# EAGLE schematic RecifierBox (EAGLE 9.4.2)
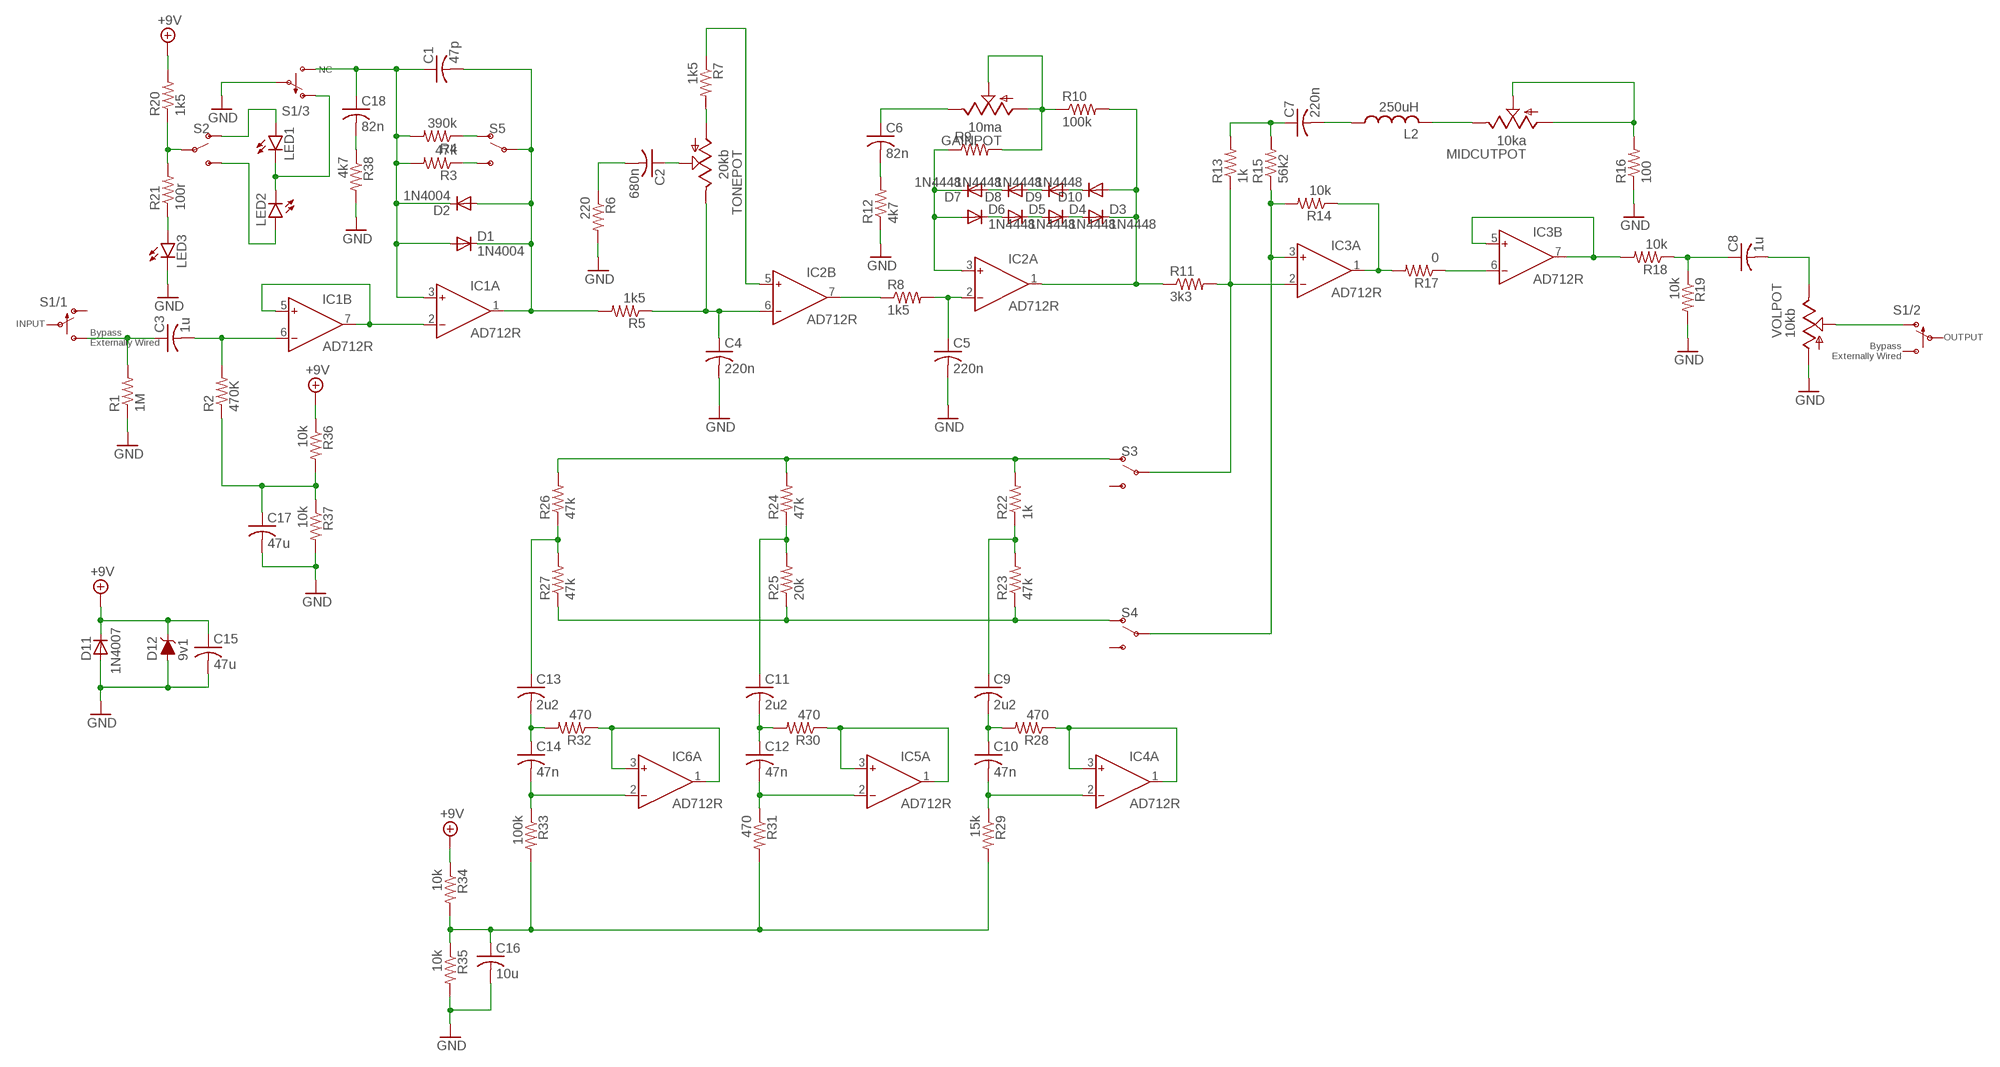
[diagram p0: schematic, sheet 1]

## Parts
C1  47p  C-USC0603  [C0603]
C2  680n  C-USC0603  [C0603]
C3  1u  C-USC0603  [C0603]
C4  220n  C-USC0603  [C0603]
C5  220n  C-USC0603  [C0603]
C6  82n  C-USC0603  [C0603]
C7  220n  C-USC0603  [C0603]
C8  1u  C-USC0603  [C0603]
C9  2u2  C-USC0603  [C0603]
C10  47n  C-USC0603  [C0603]
C11  2u2  C-USC0603  [C0603]
C12  47n  C-USC0603  [C0603]
C13  2u2  C-USC0603  [C0603]
C14  47n  C-USC0603  [C0603]
C15  47u  C-US050-025X075  [C050-025X075]
C16  10u  C-USC0603  [C0603]
C17  47u  C-US050-025X075  [C050-025X075]
C18  82n  C-USC0603  [C0603]
D1  1N4004  [DO41-10]
D2  1N4004  [DO41-10]
D3  1N4448  1N4004  [DO41-10]
D4  1N4448  1N4004  [DO41-10]
D5  1N4448  1N4004  [DO41-10]
D6  1N4448  1N4004  [DO41-10]
D7  1N4448  1N4004  [DO41-10]
D8  1N4448  1N4004  [DO41-10]
D9  1N4448  1N4004  [DO41-10]
D10  1N4448  1N4004  [DO41-10]
D11  1N4007  1N4004  [DO41-10]
D12  9v1  DIODE-ZENER-BZT52C3V6S  [SOD-323]
GAIN  10ma  THUMBPOT  [THUMBWHEEL]
IC1  AD712R  [SO8]
IC2  AD712R  [SO8]
IC3  AD712R  [SO8]
IC4  AD712R  [SO8]
IC5  AD712R  [SO8]
IC6  AD712R  [SO8]
L2  250uH  L-US0204/5  [0204/5]
LED1  LED3MM  [LED3MM]
LED2  LED3MM  [LED3MM]
LED3  LED3MM  [LED3MM]
MIDCUT  10ka  THUMBPOT  [THUMBWHEEL]
R1  1M  R-US_R0603  [R0603]
R2  470K  R-US_R0603  [R0603]
R3  47k  R-US_R0603  [R0603]
R4  390k  R-US_R0603  [R0603]
R5  1k5  R-US_R0603  [R0603]
R6  220  R-US_R0603  [R0603]
R7  1k5  R-US_R0603  [R0603]
R8  1k5  R-US_R0603  [R0603]
R9  R-US_R0603  [R0603]
R10  100k  R-US_R0603  [R0603]
R11  3k3  R-US_R0603  [R0603]
R12  4k7  R-US_R0603  [R0603]
R13  1k  R-US_R0603  [R0603]
R14  10k  R-US_R0603  [R0603]
R15  56k2  R-US_R0603  [R0603]
R16  100  R-US_R0603  [R0603]
R17  0  R-US_R0603  [R0603]
R18  10k  R-US_R0603  [R0603]
R19  10k  R-US_R0603  [R0603]
R20  1k5  R-US_R0603  [R0603]
R21  100r  R-US_R0603  [R0603]
R22  1k  R-US_R0603  [R0603]
R23  47k  R-US_R0603  [R0603]
R24  47k  R-US_R0603  [R0603]
R25  20k  R-US_R0603  [R0603]
R26  47k  R-US_R0603  [R0603]
R27  47k  R-US_R0603  [R0603]
R28  470  R-US_R0603  [R0603]
R29  15k  R-US_R0603  [R0603]
R30  470  R-US_R0603  [R0603]
R31  470  R-US_R0603  [R0603]
R32  470  R-US_R0603  [R0603]
R33  100k  R-US_R0603  [R0603]
R34  10k  R-US_R0603  [R0603]
R35  10k  R-US_R0603  [R0603]
R36  10k  R-US_R0603  [R0603]
R37  10k  R-US_R0603  [R0603]
R38  4k7  R-US_R0603  [R0603]
S1  SWITCH-3DPT-INLINE-BREAKOUT-BYPASS  [1X04]
S2  SWITCH-SPDT-PTH-11.6X4.0MM  [SWITCH_SPDT_PTH_11.6X4.0MM]
S3  SWITCH-SPDT-PTH-11.6X4.0MM  [SWITCH_SPDT_PTH_11.6X4.0MM]
S4  SWITCH-SPDT-PTH-11.6X4.0MM  [SWITCH_SPDT_PTH_11.6X4.0MM]
S5  SWITCH-SPDT-PTH-11.6X4.0MM  [SWITCH_SPDT_PTH_11.6X4.0MM]
TONE  20kb  THUMBPOT  [THUMBWHEEL]
VOL  10kb  THUMBPOT  [THUMBWHEEL]

## Nets
+9V: C15.1 D11.C D12.C R20.2 R34.1 R36.1
GND: C4.2 C5.2 C15.2 C16.2 C17.2 D11.A D12.A LED3.K(C) R1.1 R6.2 R12.1 R16.1 R19.2 R35.2 R37.2 R38.2 S1.3(/3:COMMON) VOL.1(POT:A)
N$1: C3.1 R1.2
N$2: C3.2 IC1.6(B:IN-) R2.2
N$4: C18.2 R38.1
N$5: IC1.2(A:IN-) IC1.5(B:IN+) IC1.7(B:OUT)
N$6: C1.1 C18.1 D1.A D2.C IC1.3(A:IN+) R3.2 R4.2
N$7: C2.2 R6.1
N$8: C2.1 TONE.2(POT:S)
N$9: R7.2 TONE.1(POT:A)
N$10: IC2.5(B:IN+) R7.1
N$11: C4.1 IC2.6(B:IN-) R5.1 TONE.3(POT:E)
N$12: IC2.7(B:OUT) R8.1
N$13: C5.1 IC2.2(A:IN-) R8.2
N$14: D5.A D6.C
N$15: D4.A D5.C
N$16: D3.A D4.C
N$17: D7.A D8.C
N$18: D8.A D9.C
N$19: D9.A D10.C
N$20: D6.A D7.C IC2.3(A:IN+) R9.1
N$21: GAIN.1(POT:A) GAIN.2(POT:S) R9.2 R10.1
N$22: D3.C D10.A IC2.1(A:OUT) R10.2 R11.1
N$23: C6.2 R12.2
N$24: C6.1 GAIN.3(POT:E)
N$25: IC3.2(A:IN-) R11.2 R13.1 S3.2(P)
N$26: C7.1 R13.2 R15.2
N$27: IC3.3(A:IN+) R14.2 R15.1 S4.2(P)
N$28: C7.2 L2.1
N$29: L2.2 MIDCUT.3(POT:E)
N$30: MIDCUT.1(POT:A) MIDCUT.2(POT:S) R16.2
N$31: IC3.1(A:OUT) R14.1 R17.2
N$32: IC3.6(B:IN-) R17.1
N$33: IC3.5(B:IN+) IC3.7(B:OUT) R18.2
N$34: C8.1 R18.1 R19.1
N$35: C8.2 VOL.3(POT:E)
N$36: S1.2(/2:NORMALLY-ON) VOL.2(POT:S)
N$37: LED1.K(C) LED2.K(C) S1.4(/3:NORMALLY-ON)
N$38: R20.1 R21.2 S2.2(P)
N$39: LED1.A S2.1(O)
N$40: LED2.A S2.3(S)
N$41: LED3.A R21.1
N$42: R22.2 R24.2 R26.2 S3.1(O)
N$43: R23.1 R25.1 R27.1 S4.1(O)
N$44: C9.1 R22.1 R23.2
N$45: C16.1 R29.2 R31.2 R33.2 R34.2 R35.1
N$46: C11.1 R24.1 R25.2
N$47: C9.2 C10.1 R28.2
N$48: IC4.1(A:OUT) IC4.3(A:IN+) R28.1
N$49: C10.2 IC4.2(A:IN-) R29.1
N$50: C17.1 R2.1 R36.2 R37.1
N$51: C13.1 R26.1 R27.2
N$52: C11.2 C12.1 R30.2
N$53: IC5.1(A:OUT) IC5.3(A:IN+) R30.1
N$54: C12.2 IC5.2(A:IN-) R31.1
N$55: C13.2 C14.1 R32.2
N$56: IC6.1(A:OUT) IC6.3(A:IN+) R32.1
N$57: C14.2 IC6.2(A:IN-) R33.1
N$58: R3.1 S5.3(S)
N$59: R4.1 S5.1(O)
N$60: C1.2 D1.C D2.A IC1.1(A:OUT) R5.2 S5.2(P)
Unconnected: GAIN.SW1(SW:S) GAIN.SW2(SW:P) IC4.5(B:IN+) IC4.6(B:IN-) IC4.7(B:OUT) IC5.5(B:IN+) IC5.6(B:IN-) IC5.7(B:OUT) IC6.5(B:IN+) IC6.6(B:IN-) IC6.7(B:OUT) MIDCUT.SW1(SW:S) MIDCUT.SW2(SW:P) S1.1(/1:NORMALLY-ON) S3.3(S) S4.3(S) TONE.SW1(SW:S) TONE.SW2(SW:P) VOL.SW1(SW:S) VOL.SW2(SW:P)

## Power pins joined to a net without a drawn wire
V+: IC1.8(P:V+) IC2.8(P:V+) IC3.8(P:V+) IC4.8(P:V+) IC5.8(P:V+) IC6.8(P:V+)
V-: IC1.4(P:V-) IC2.4(P:V-) IC3.4(P:V-) IC4.4(P:V-) IC5.4(P:V-) IC6.4(P:V-)

## Library data of the parts
C1-C18 = rcl:C-US: CAPACITOR, American symbol; SPICEPREFIX: C
D1-D11 = adafruit:1N4004: DIODE General purpose 1N400x type rectifier (With bigger pads) http://www.ladyada.net/library/pcb/eaglelibrary.html
D12 = SparkFun-DiscreteSemi:DIODE-ZENER: Zener Diode A Zener diode allows current to flow from its anode to its cathode like a normal semiconductor diode, but it also permits current to flow in the reverse direction when its "Zener voltage" is reached. - WIkipedia; PROD_ID: DIO-08199; VALUE: 3.6V
GAIN MIDCUT TONE VOL = adafruit:THUMBPOT: Thumbwheel pot with switch Available in horizontal (Alpha RV121SF) or vertical (Xicon 311-1701)
IC1-IC6 = analog-devices:AD712: Dual Precision, Low Cost, High Speed BiFET Op Amp Source: http://www.analog.com/static/imported-files/data_sheets/AD712.pdf; MF: ALTERA CORPORATION; MPN: AD712KRZ; OC_FARNELL: 1263975; OC_NEWARK: 59K4556
L2 = rcl:L-US: INDUCTOR, American symbol; SPICEPREFIX: L
LED1-LED3 = led:LED: LED OSRAM: - CHIPLED LG R971, LG N971, LY N971, LG Q971, LY Q971, LO R971, LY R971 LH N974, LH R974 LS Q976, LO Q976, LY Q976 LO Q996 - Hyper CHIPLED LW Q18S LB Q993, LB Q99A, LB R99A - SideLED LS A670, LO A670, LY A670, LG A670, LP A670 LB A673, LV A673, LT A673, LW A673 LH A674 LY A675 LS A676, LA A676, LO A676, LY A676, LW A676 LS A679, LY A679, LG A679 - Hyper Micro SIDELED® LS Y876, LA Y876, LO Y876, LY Y876 LT Y87S - SmartLED LW L88C, LW L88S LB L89C, LB L89S, LG L890 LS L89K, LO L89K, LY L89K LS L896, LA L896, LO L896, LY L896 - TOPLED LS T670, LO T670, LY T670, LG T670, LP T670 LSG T670, LSP T670, LSY T670, LOP T670, LYG T670 LG T671, LOG T671, LSG T671 LB T673, LV T673, LT T673, LW T673 LH T674 LS T676, LA T676, LO T676, LY T676, LB T676, LH T676, LSB T676, LW T676 LB T67C, LV T67C, LT T67C, LS T67K, LO T67K, LY T67K, LW E67C LS E67B, LA E67B, LO E67B, LY E67B, LB E67C, LV E67C, LT E67C LW T67C LS T679, LY T679, LG T679 LS T770, LO T770, LY T770, LG T770, LP T770 LB T773, LV T773, LT T773, LW T773 LH T774 LS E675, LA E675, LY E675, LS T675 LS T776, LA T776, LO T776, LY T776, LB T776 LHGB T686 LT T68C, LB T68C - Hyper Mini TOPLED® LB M676 - Mini TOPLED Santana® LG M470 LS M47K, LO M47K, LY M47K Source: http://www.osram.convergy.de LUXEON: - LUMILED® LXK2-PW12-R00, LXK2-PW12-S00, LXK2-PW14-U00, LXK2-PW14-V00 LXK2-PM12-R00, LXK2-PM12-S00, LXK2-PM14-U00 LXK2-PE12-Q00, LXK2-PE12-R00, LXK2-PE12-S00, LXK2-PE14-T00, LXK2-PE14-U00 LXK2-PB12-K00, LXK2-PB12-L00, LXK2-PB12-M00, LXK2-PB14-N00, LXK2-PB14-P00, LXK2-PB14-Q00 LXK2-PR12-L00, LXK2-PR12-M00, LXK2-PR14-Q00, LXK2-PR14-R00 LXK2-PD12-Q00, LXK2-PD12-R00, LXK2-PD12-S00 LXK2-PH12-R00, LXK2-PH12-S00 LXK2-PL12-P00, LXK2-PL12-Q00, LXK2-PL12-R00 Source: www.luxeon.com KINGBRIGHT: KA-3528ASYC Source: www.kingbright.com
R1-R38 = rcl:R-US_: RESISTOR, American symbol; SPICEPREFIX: R
S1 = pedalPartsLibrary:SWITCH-3DPT-INLINE-BREAKOUT-BYPASS
S2-S5 = SparkFun-Switches:SWITCH-SPDT: Single Pole, Double Throw (SPDT) Switch Single-pole, double-throw (SPDT) switch. Variant Overview SMD-AYZ0202 Surface Mount DPDT Switch <https://www.sparkfun.com/products/597> (COM-00597) Used on e.g. LilyPad Arduino USB - ATmega32U4 Board <https://www.sparkfun.com/products/12049> PTH-11.6X4.0MM SPDT Mini Power Switch <https://www.sparkfun.com/products/102> (COM-00102) Used on e.g. SparkFun Simon Says - Through-Hole Soldering Kit <https://www.sparkfun.com/products/10547> (KIT-10547) PTH-11.6X4.0MM-KIT KIT version of SPDT Mini Power Switch - Simplifies soldering by removing tStop of switch pins - only one side can be soldered. PTH-11.6X4.0MM-LOCK LOCK version of SPDT Mini Power Switch - Offset pins hold switch in place for easier soldering. SMD-RIGHT-ANGLE Surface Mount Right Angle Switch <https://www.sparkfun.com/products/10860> (COM-10860) Used on e.g. SparkFun ESP8266 Thing <https://www.sparkfun.com/products/13231>; PROD_ID: SWCH-08261; SF_SKU: COM-00102